# EAGLE design op-mozzi-shield (EAGLE 6.1)
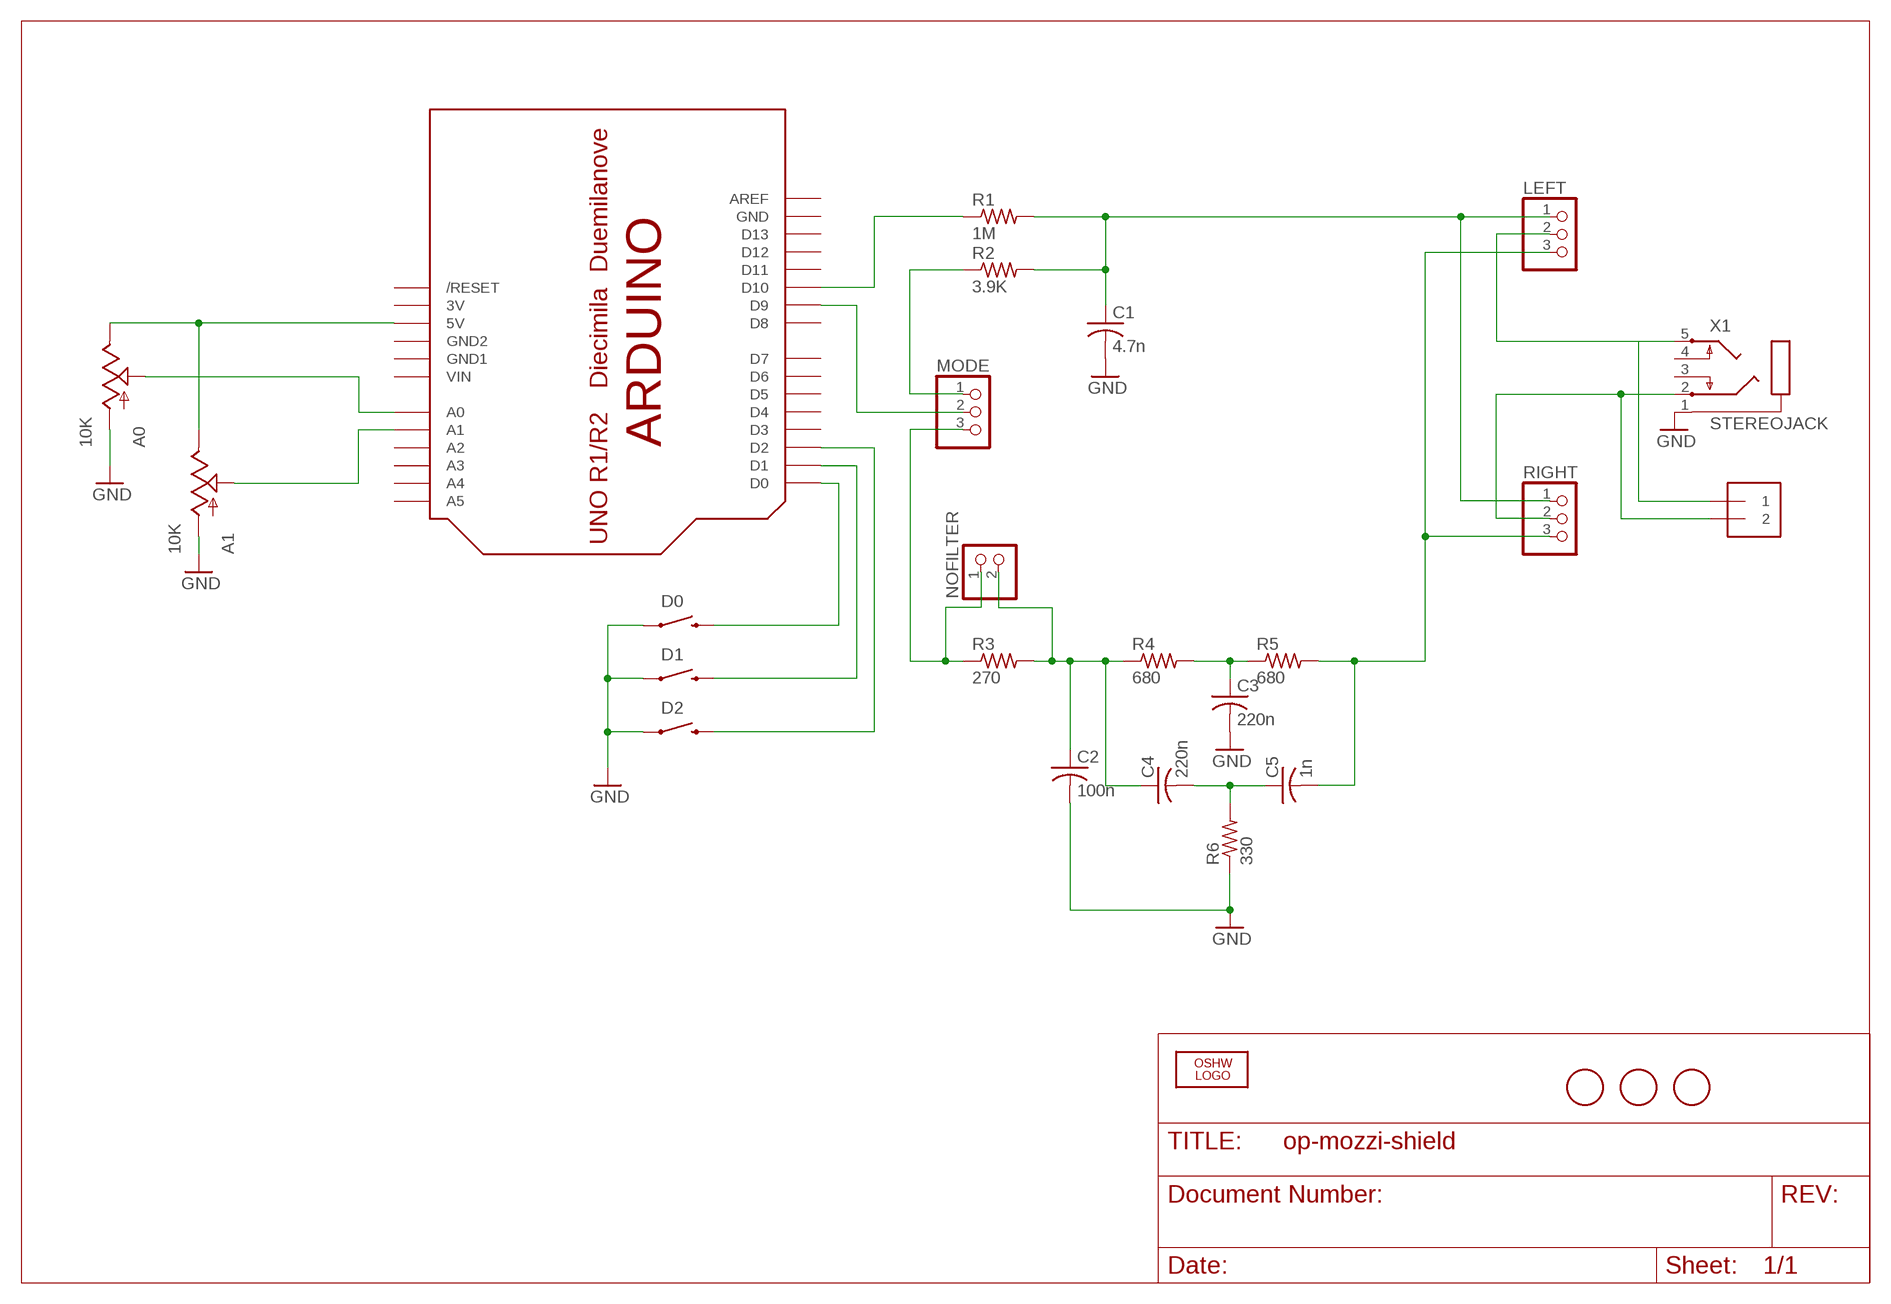
[diagram p0: schematic, sheet 1]

## Parts
A0  10K  POT  [ALPS_POT]
A1  10K  POT  [ALPS_POT]
AUDIO  1X2-3.5MM  [1X2-3.5MM]
C1  4.7n  C-USC0805  [C0805]
C2  100n  C-USC0805  [C0805]
C3  220n  C-USC0805  [C0805]
C4  220n  C-USC0805  [C0805]
C5  1n  C-USC0805  [C0805]
D0  SWITCH-MOMENTARY-212MM  [TACTILE-PTH-12MM]
D1  SWITCH-MOMENTARY-212MM  [TACTILE-PTH-12MM]
D2  SWITCH-MOMENTARY-212MM  [TACTILE-PTH-12MM]
LEFT  PINHD-1X3  [1X03]
LOGO1  OSHW_LOGO_FILLX0200-NT  [OSHW_FILLX200_NOTEXT]
MODE  PINHD-1X3  [1X03]
NOFILTER  PINHD-1X2  [1X02]
R1  1M  R-US_R0805  [R0805]
R2  3.9K  R-US_R0805  [R0805]
R3  270  R-US_R0805  [R0805]
R4  680  R-US_R0805  [R0805]
R5  680  R-US_R0805  [R0805]
R6  330  R-US_R0805  [R0805]
RIGHT  PINHD-1X3  [1X03]
U$1  ARDUINO-NODIM  [ARDUINO-NODIM]
U$4  FIDUCIAL  [FIDUCIAL_1MM]
U$5  FIDUCIAL  [FIDUCIAL_1MM]
U$6  FIDUCIAL  [FIDUCIAL_1MM]
X1  STEREOJACK  [STX3100]

## Nets
GND: A0.P$3(A) A1.P$3(A) C1.2 C2.2 C3.2 D0.1 D1.1 D2.1 R6.1 X1.1
N$1: AUDIO.1 LEFT.2 X1.5
N$2: AUDIO.2 RIGHT.2 X1.2
N$3: C1.1 LEFT.1 R1.2 R2.2 RIGHT.1
N$4: C2.1 C4.1 NOFILTER.2 R3.2 R4.1
N$5: C4.2 C5.1 R6.2
N$6: C3.1 R4.2 R5.1
N$7: C5.2 LEFT.3 R5.2 RIGHT.3
N$8: R1.1 U$1.D10
N$9: MODE.2 U$1.D9
N$10: MODE.1 R2.1
N$11: MODE.3 NOFILTER.1 R3.1
N$12: A0.P$2(S) U$1.A0
N$13: A1.P$2(S) U$1.A1
N$14: A0.P$1(E) A1.P$1(E) U$1.5V
N$15: D0.3 U$1.D0
N$16: D1.3 U$1.D1
N$17: D2.3 U$1.D2
Unconnected: U$1.A2 U$1.A3 U$1.A4 U$1.A5 U$1.AREF U$1.D3 U$1.D4 U$1.D5 U$1.D6 U$1.D7 U$1.D8 U$1.D11 U$1.D12 U$1.D13 U$1.RESET(/RESET) X1.3 X1.4

## Power pins joined to a net without a drawn wire
3V: U$1.3V
GND: U$1.GND
GND1: U$1.GND1
GND2: U$1.GND2
VIN: U$1.VIN

## Library data of the parts
A0 A1 = SparkFun-Electromechanical:POT
AUDIO = adafruit:1X2: 3.5mm Terminal block http://www.ladyada.net/library/pcb/eaglelibrary.html
C1-C5 = adafruit:C-US: CAPACITOR, American symbol
D0 D1 D2 = SparkFun-Electromechanical:SWITCH-MOMENTARY-2: Various NO switches- pushbuttons, reed, etc
LEFT MODE RIGHT = adafruit:PINHD-1X3: PIN HEADER
LOGO1 = ohw-logo:OSHW_LOGO_FILL
NOFILTER = pinhead:PINHD-1X2: PIN HEADER
R1-R6 = adafruit:R-US_: RESISTOR, American symbol
U$1 = adafruit:ARDUINO: Arduino Diecimila/Duemilanove Make a shield with ease, this package has all the named pins as well as the two mounting drill holes and an outline of the USB and DC power connector. The outline is on the DIMENSION layer, so if your board house uses it they will cut the outline to match. http://www.ladyada.net/library/pcb/eaglelibrary.html
U$4-U$6 = adafruit:FIDUCIAL: For use by pick and place machines to calibrate the vision/machine, 1mm By microbuilder.eu
X1 = adafruit:STEREOJACK: MIC/HEADPHONE JACK Stereo jack with two switches. Kycon STX3100, CUI SJ1-3555NG and/or 4UCon 05544

## Board
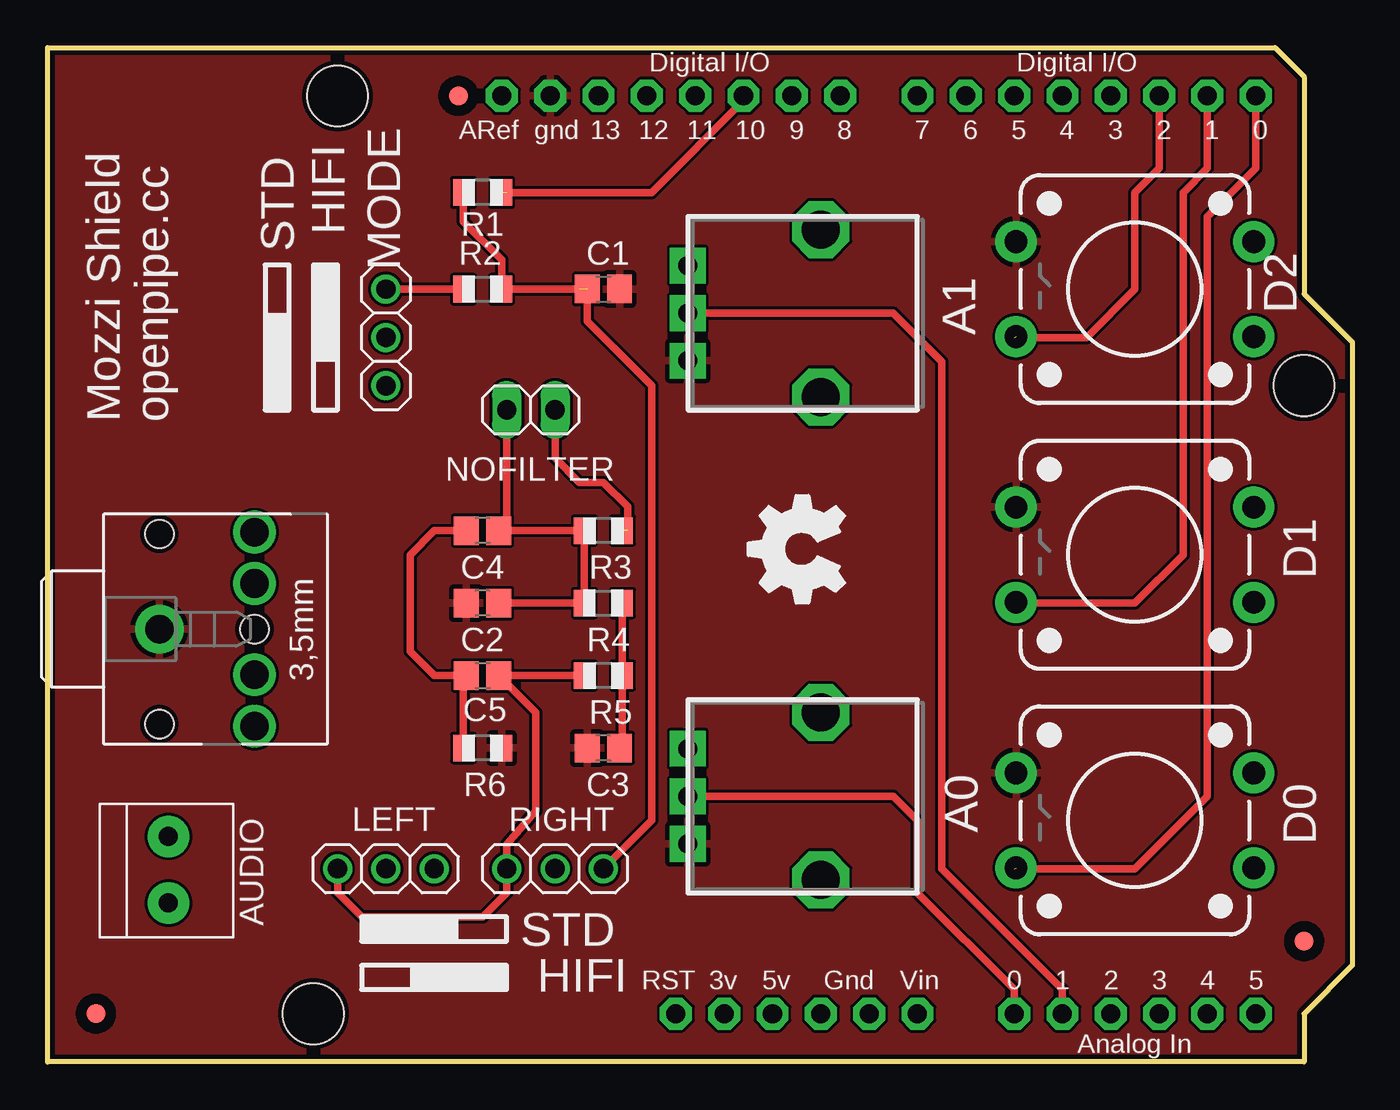
[diagram p1: board, top side]
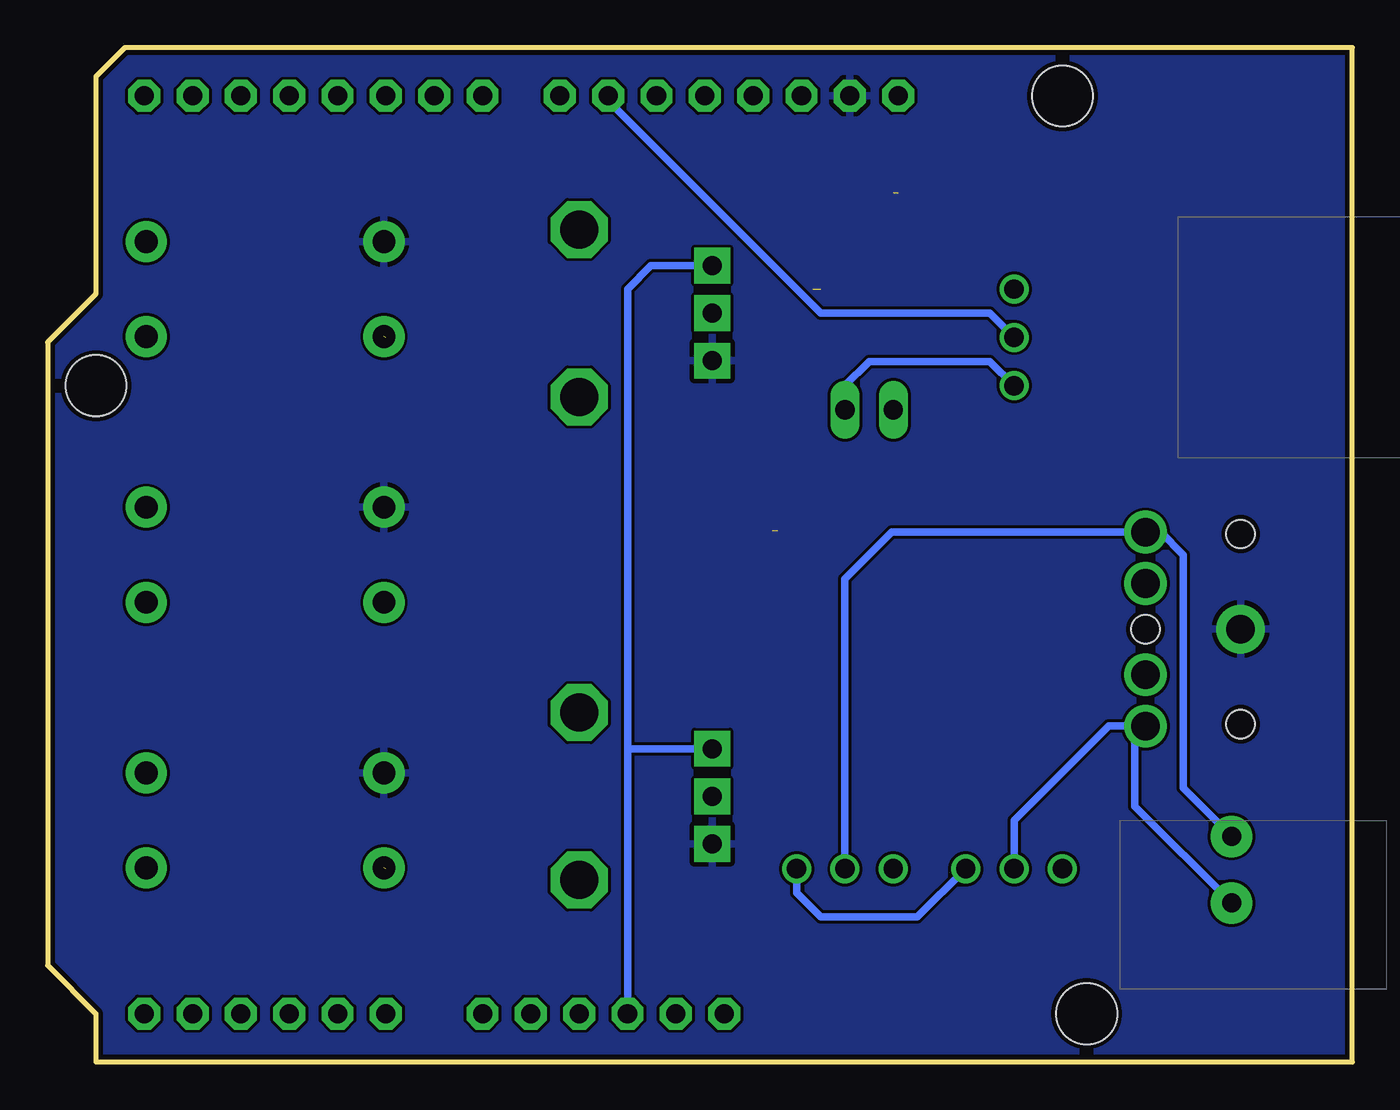
[diagram p2: board, bottom side, seen from below]

Size 68.58 x 53.34 mm. Coordinates in mm from the lower left corner, seen from the top.
Outline: 0,0 0,53.34 64.52,53.34 66.04,51.82 66.04,40.39 68.58,37.85 68.58,5.08 66.04,2.54 66.04,0 0,0
Copper layers (1*16): Top 0.035mm / dielectric 1.5mm / Bottom 0.035mm
Design rules: minimum track width 6mil, minimum drill 12mil, track to track 6mil, track to pad 6mil, pad to pad 6mil, via to via 6mil, smd to smd 0mil, copper to edge 10mil, drill to drill 10mil, minimum pad ring 10mil, minimum via ring 6mil, stop-mask expansion 2mil, vias tented up to drill 100mil, thermal gap 10mil

### Footprints (pad centres in the part's own frame; a part is rotated, then mirrored left to right if it is on the bottom)
ALPS_POT = drill 1 pad 1.88 square: P$1 7,-2.5; P$2 7,0; P$3 7,2.5 | drill 2 octagon: P$4 0,-4.4; P$5 0,4.4
1X2-3.5MM = drill 1 pad 2.184: 1 1.8,0; 2 -1.7,0
C0805 = smd 1.3 x 1.5: 1 -0.85,0; 2 0.85,0
TACTILE-PTH-12MM = drill 1.2 pad 2.159: 1 6.25,-2.5; 2 -6.25,-2.5; 3 6.25,2.5; 4 -6.25,2.5
1X03 = drill 1.016: 1 -2.54,0; 2 0,0; 3 2.54,0
1X02 = drill 1.016 long: 1 -1.27,0; 2 1.27,0
R0805 = smd 1.1 x 1.4: 1 -1,0; 2 1,0
ARDUINO-NODIM = drill 1 pad 1.676 octagon: 3V 35.56,2.54; 5V 38.1,2.54; A0 50.8,2.54; A1 53.34,2.54; A2 55.88,2.54; A3 58.42,2.54; A4 60.96,2.54; A5 63.5,2.54; AREF 23.876,50.8; D0 63.5,50.8; D1 60.96,50.8; D2 58.42,50.8; D3 55.88,50.8; D4 53.34,50.8; D5 50.8,50.8; D6 48.26,50.8; D7 45.72,50.8; D8 41.656,50.8; D9 39.116,50.8; D10 36.576,50.8; D11 34.036,50.8; D12 31.496,50.8; D13 28.956,50.8; GND 26.416,50.8; GND1 43.18,2.54; GND2 40.64,2.54; RESET 33.02,2.54; VIN 45.72,2.54 | hole 3.2: 15.24,50.8; 66.04,35.56; 13.97,2.54
FIDUCIAL_1MM = smd 1 x 1: 1 0,0
STX3100 = drill 1.5 pad 2.54: 1 2.7,-0.1 | drill 1.5: 2 7.7,5; 3 7.7,2.3; 4 7.7,-2.5; 5 7.7,-5.2 | hole 1.5: 2.7,4.9; 2.7,-5.1; 7.7,-0.1

### Placement (x,y rotation side)
A0  40.64,13.97 180 top
A1  40.64,39.37 180 top
AUDIO  6.35,10.16 270 top
C1  29.21,40.64 0 top
C2  22.86,24.13 180 top
C3  29.21,16.51 180 top
C4  22.86,27.94 180 top
C5  22.86,20.32 0 top
D0  57.15,12.7 180 top
D1  57.15,26.67 180 top
D2  57.15,40.64 180 top
LEFT  17.78,10.16 180 top
LOGO1  41.91,24.13 90 top
MODE  17.78,38.1 270 top
NOFILTER  25.4,34.29 180 top
R1  22.86,45.72 180 top
R2  22.86,40.64 0 top
R3  29.21,27.94 180 top
R4  29.21,24.13 0 top
R5  29.21,20.32 180 top
R6  22.86,16.51 180 top
RIGHT  26.67,10.16 180 top
U$1  0,0 0 top
U$4  2.54,2.54 0 top
U$5  21.59,50.8 0 top
U$6  66.04,6.35 0 top
X1  3.17,22.86 0 top

### Tracks (layer width: path | path; a pad name or v marks a point on that pad's centre or on a via)
GND
  pour Top: 0,0 0,53.34 68.58,53.34 68.58,0
  pour Bottom: 0,0 0,53.34 68.58,53.34 68.58,0
N$1
  Bottom 0.406: X1.5 11.43,17.66 | 11.43,17.66 12.82,17.66 17.78,12.7 LEFT.2 | AUDIO.1 11.43,13.44 11.43,17.66
N$2
  Bottom 0.406: RIGHT.2 26.67,25.4 24.21,27.86 X1.2 10.08,27.86 8.89,26.67 8.89,14.4 AUDIO.2
N$3  (1 unrouted)
  Top 0.406: R1.2 21.86,44.18 23.86,42.18 R2.2 27.94,40.64 | C1.1 28.36,38.95 31.75,35.56 31.75,12.7 RIGHT.1
  Bottom 0.406: LEFT.1 22.86,7.62 27.94,7.62 29.21,8.89 RIGHT.1
N$4
  Top 0.406: C4.1 24.13,27.94 | 24.13,27.94 R3.2 R4.1 C2.1 | NOFILTER.2 24.13,27.94
N$5
  Top 0.406: R6.2 21.86,20.17 C5.1 20.32,20.32 19.05,21.59 19.05,26.67 20.32,27.94 C4.2
N$6
  Top 0.406: R4.2 R5.1 30.21,16.66 C3.1
N$7
  Top 0.406: R5.2 C5.2 25.65,18.38 25.65,13.21 24.13,11.43 RIGHT.3 24.13,8.89 22.86,7.62 16.51,7.62 15.24,8.89 LEFT.3
N$8  (1 unrouted)
  Top 0.406: U$1.D10 36.58,50.55 31.75,45.72 24.13,45.72
N$9
  Bottom 0.406: U$1.D9 39.12,50.55 27.94,39.37 19.05,39.37 MODE.2
N$10
  Top 0.406: MODE.1 R2.1
N$11  (1 unrouted)
  Top 0.406: NOFILTER.1 26.67,31.75 27.94,30.48 29.21,30.48 30.48,29.21 30.48,27.94
  Bottom 0.406: NOFILTER.1 26.67,35.56 25.4,36.83 19.05,36.83 MODE.3
N$12
  Top 0.406: A0.P$2 44.45,13.97 45.72,12.7 45.72,8.89 50.8,3.81 U$1.A0
N$13
  Top 0.406: A1.P$2 44.45,39.37 46.99,36.83 46.99,10.16 53.34,3.81 U$1.A1
N$14
  Bottom 0.406: A1.P$1 36.87,41.87 38.1,40.64 38.1,16.51 | 38.1,16.51 U$1.5V | A0.P$1 38.06,16.47 38.1,16.51
N$15  (1 unrouted)
  Top 0.406: U$1.D0 63.5,46.99 60.96,44.45 60.96,13.97 57.15,10.16 50.8,10.16
N$16
  Top 0.406: U$1.D1 60.96,46.99 59.69,45.72 59.69,26.67 57.15,24.13 50.94,24.13 D1.3
N$17  (1 unrouted)
  Top 0.406: U$1.D2 58.42,46.99 57.15,45.72 57.15,40.64 54.61,38.1 50.8,38.1

### Text on the board
tPlace: MODE | STD | HIFI | A1 | D2 | Mozzi Shield | openpipe.cc | D1 | A0 | D0 | STD | HIFI